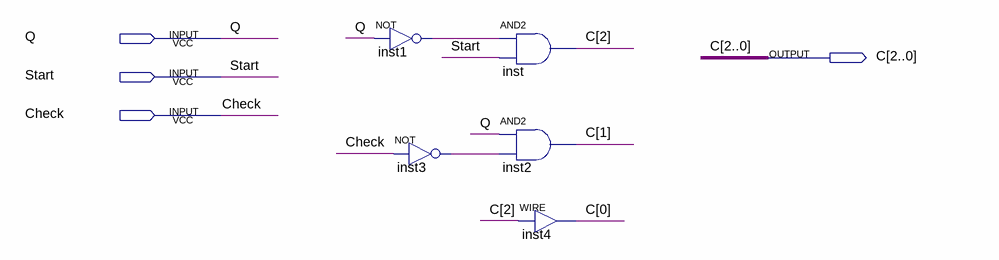
[diagram p0: schematic sheet]
// Quartus schematic OutputBlock2.bdf as structural Verilog: 5 symbols, 4 pins
module OutputBlock2 (
  input  Q,
  input  Start,
  input  Check,
  output [2:0] C
);

  wire inst1_out, inst3_out;

  not inst1 (inst1_out, Q);
  not inst3 (inst3_out, Check);
  and inst (C[2], inst1_out, Start);
  and inst2 (C[1], Q, inst3_out);
  assign C[0] = C[2];  // WIRE inst4
endmodule
